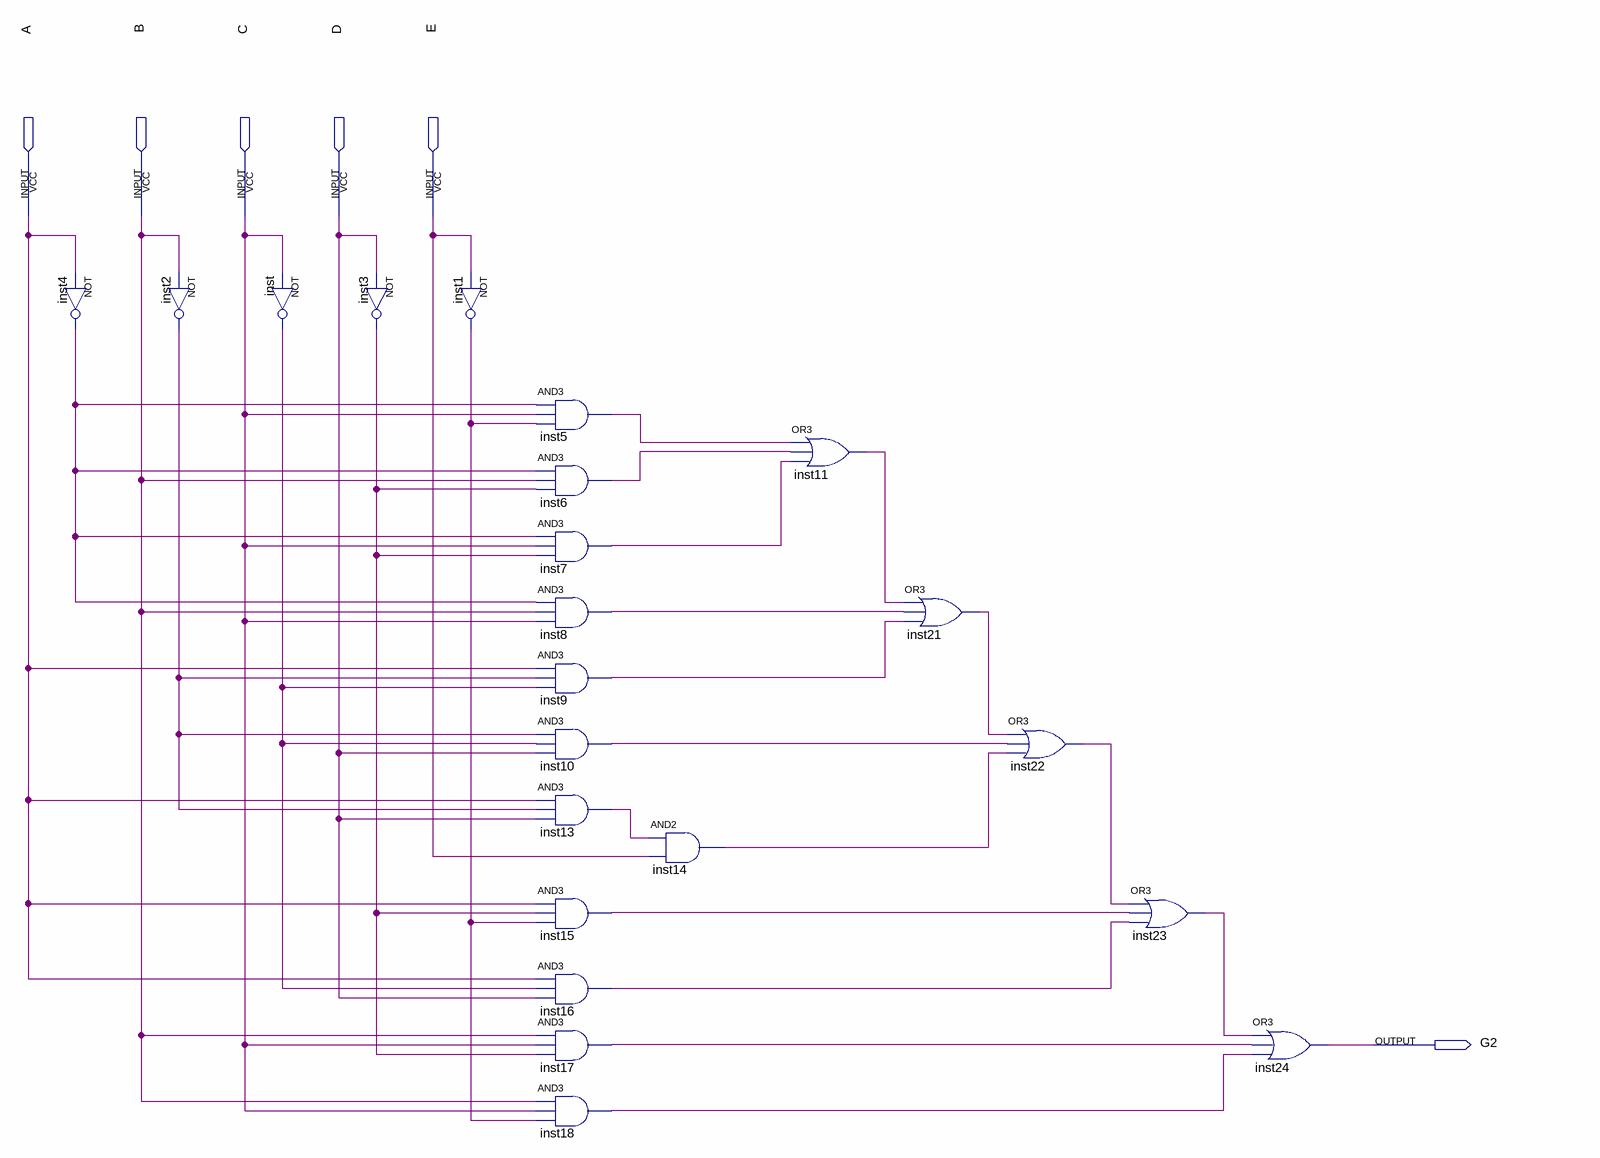
[diagram p0: schematic sheet]
// Quartus schematic led-G2.bdf as structural Verilog: 22 symbols, 6 pins
module \led-G2  (
  input  A,
  input  B,
  input  C,
  input  D,
  input  E,
  output G2
);

  wire inst1_out, inst2_out, inst3_out, inst4_out, inst5_out, inst6_out, inst7_out, inst8_out, inst9_out,
       inst10_out, inst11_out, inst13_out, inst14_out, inst15_out, inst16_out, inst17_out, inst18_out,
       inst21_out, inst22_out, inst23_out, inst_out;

  not inst4 (inst4_out, A);
  not inst2 (inst2_out, B);
  not inst (inst_out, C);
  not inst3 (inst3_out, D);
  not inst1 (inst1_out, E);
  and inst5 (inst5_out, inst4_out, C, inst1_out);
  and inst6 (inst6_out, inst4_out, B, inst3_out);
  and inst7 (inst7_out, inst4_out, C, inst3_out);
  and inst8 (inst8_out, inst4_out, B, C);
  and inst9 (inst9_out, A, inst2_out, inst_out);
  and inst10 (inst10_out, inst2_out, inst_out, D);
  and inst13 (inst13_out, A, inst2_out, D);
  and inst15 (inst15_out, A, inst3_out, inst1_out);
  and inst16 (inst16_out, A, inst_out, D);
  and inst17 (inst17_out, B, C, inst3_out);
  and inst18 (inst18_out, B, C, inst1_out);
  and inst14 (inst14_out, inst13_out, E);
  or inst11 (inst11_out, inst5_out, inst6_out, inst7_out);
  or inst21 (inst21_out, inst11_out, inst8_out, inst9_out);
  or inst22 (inst22_out, inst21_out, inst10_out, inst14_out);
  or inst23 (inst23_out, inst22_out, inst15_out, inst16_out);
  or inst24 (G2, inst23_out, inst17_out, inst18_out);
endmodule
